# Altium schematic sheet FlyControl.SchDoc: FlyControl
size A4; Organization: Altium Limited; Address1: L3, 12a Rodborough Rd; Address2: Frenchs Forest; Address3: NSW; Address4: Australia 2086
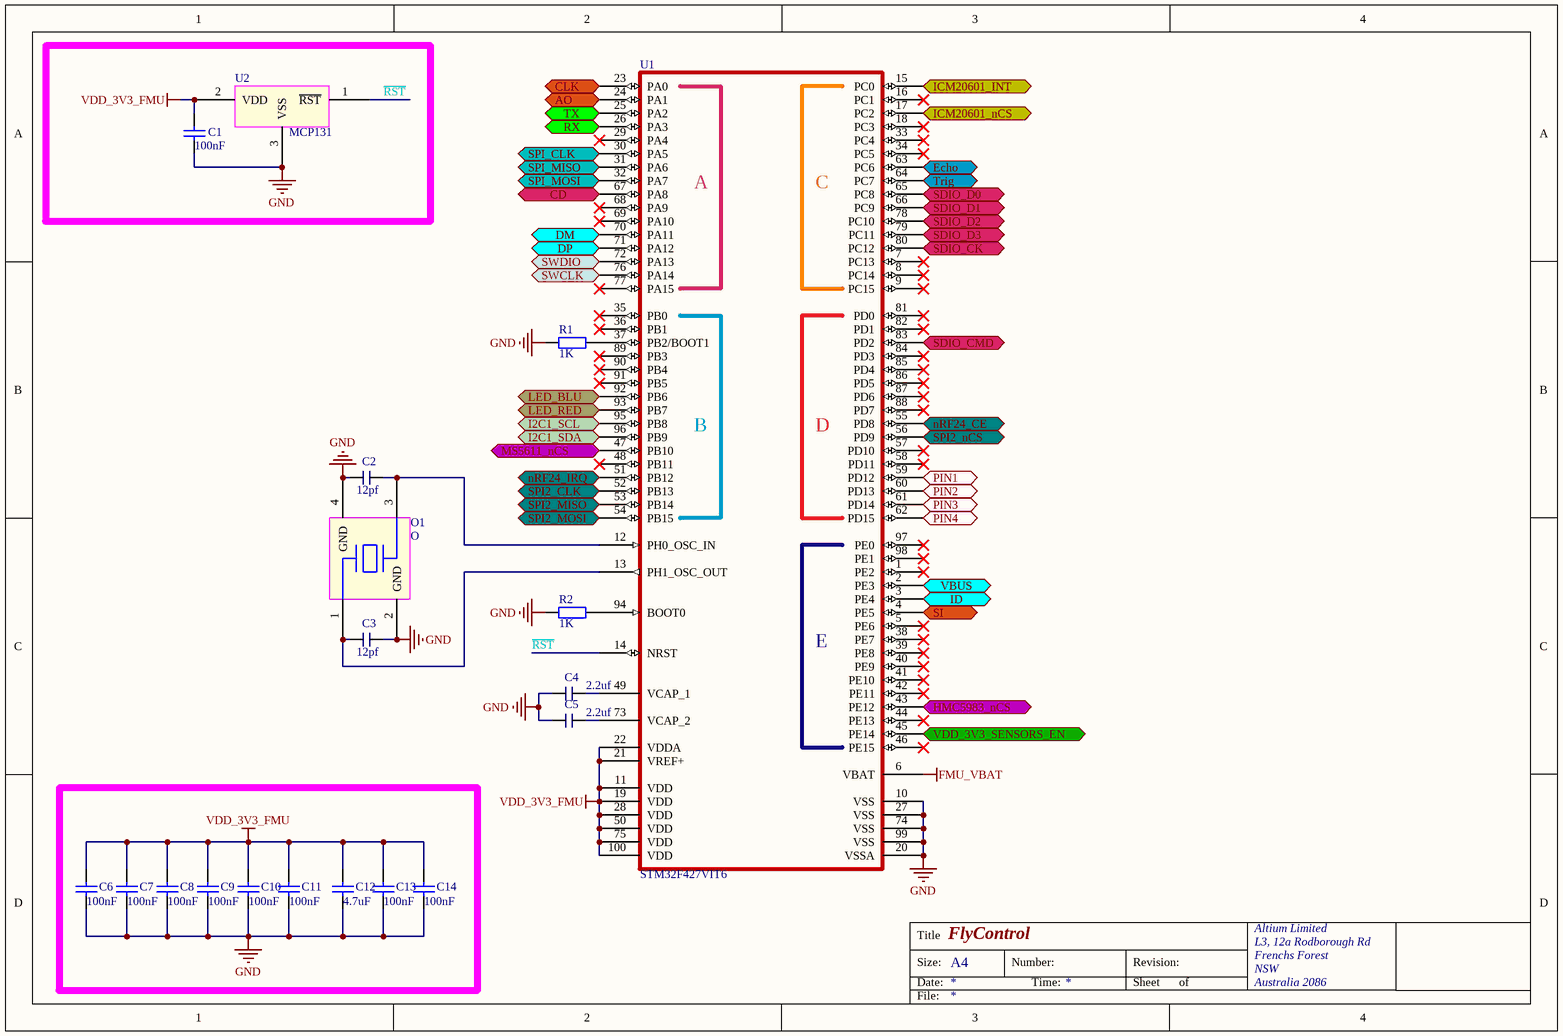
[diagram p0: FlyControl.SchDoc]

## Parts
C1  value 100nF  [0603AC]  (hidden comment: Cap1)
C2  value 12pf  [0603AC]  (hidden comment: Capacity)
C3  value 12pf  [0603AC]  (hidden comment: Capacity)
C4  value 2.2uf  [0603AC]  (hidden comment: Capacity)
C5  value 2.2uf  [0603AC]  (hidden comment: Capacity)
C6  value 100nF  [0603AC]  (hidden comment: Cap1)
C7  value 100nF  [0603AC]  (hidden comment: Cap1)
C8  value 100nF  [0603AC]  (hidden comment: Cap1)
C9  value 100nF  [0603AC]  (hidden comment: Cap1)
C10  value 100nF  [0603AC]  (hidden comment: Cap1)
C11  value 100nF  [0603AC]  (hidden comment: Cap1)
C12  value 4.7uF  [0603AC]  (hidden comment: Cap1)
C13  value 100nF  [0603AC]  (hidden comment: Cap1)
C14  value 100nF  [0603AC]  (hidden comment: Cap1)
O1  O  [SMD_3225]
R1  value 1K  [0603AR]  (hidden comment: Resist)
R2  value 1K  [0603AR]  (hidden comment: Resist)
U1  STM32F427VIT6  [LQFP50P1600X1600X160-100N]
U2  MCP131  [SOT23]

## Ports
AO, CD, CLK, DM, DP, Echo, HMC5983_nCS, I2C1_SCL, I2C1_SDA, ICM20601_INT, ICM20601_nCS, ID, LED_BLU, LED_RED, MS5611_nCS, nRF24_CE, nRF24_IRQ, PIN1, PIN2, PIN3, PIN4, RX, SDIO_CK, SDIO_CMD, SDIO_D0, SDIO_D1, SDIO_D2, SDIO_D3, SI, SPI2_CLK, SPI2_MISO, SPI2_MOSI, SPI2_nCS, SPI_CLK, SPI_MISO, SPI_MOSI, SWCLK, SWDIO, Trig, TX, VBUS, VDD_3V3_SENSORS_EN

## Nets
FMU_VBAT: U1.6(VBAT)
GND: C1.1 C2.1 C3.2 C4.1 C5.1 C6.1 C7.1 C8.1 C9.1 C10.1 C11.1 C12.1 C13.1 C14.1 O1.2(GND) O1.4(GND) R1.1 R2.1 U1.10(VSS) U1.20(VSSA) U1.27(VSS) U1.74(VSS) U1.99(VSS) U2.3(VSS)
VDD_3V3_FMU: C1.2 C6.2 C7.2 C8.2 C9.2 C10.2 C11.2 C12.2 C13.2 C14.2 U1.11(VDD) U1.19(VDD) U1.21(VREF+) U1.22(VDDA) U1.28(VDD) U1.50(VDD) U1.75(VDD) U1.100(VDD) U2.2(VDD)
AO: U1.24(PA1) ; port AO
CD: U1.67(PA8) ; port CD
CLK: U1.23(PA0) ; port CLK
DM: U1.70(PA11) ; port DM
DP: U1.71(PA12) ; port DP
Echo: U1.63(PC6) ; port Echo
HMC5983_nCS: U1.43(PE12) ; port HMC5983_nCS
I2C1_SCL: U1.95(PB8) ; port I2C1_SCL
I2C1_SDA: U1.96(PB9) ; port I2C1_SDA
ICM20601_INT: U1.15(PC0) ; port ICM20601_INT
ICM20601_nCS: U1.17(PC2) ; port ICM20601_nCS
ID: U1.3(PE4) ; port ID
LED_BLU: U1.92(PB6) ; port LED_BLU
LED_RED: U1.93(PB7) ; port LED_RED
MS5611_nCS: U1.47(PB10) ; port MS5611_nCS
nRF24_CE: U1.55(PD8) ; port nRF24_CE
nRF24_IRQ: U1.51(PB12) ; port nRF24_IRQ
PIN1: U1.59(PD12) ; port PIN1
PIN2: U1.60(PD13) ; port PIN2
PIN3: U1.61(PD14) ; port PIN3
PIN4: U1.62(PD15) ; port PIN4
~{RST}: U1.14(NRST) U2.1(~{RST})
RX: U1.26(PA3) ; port RX
SDIO_CK: U1.80(PC12) ; port SDIO_CK
SDIO_CMD: U1.83(PD2) ; port SDIO_CMD
SDIO_D0: U1.65(PC8) ; port SDIO_D0
SDIO_D1: U1.66(PC9) ; port SDIO_D1
SDIO_D2: U1.78(PC10) ; port SDIO_D2
SDIO_D3: U1.79(PC11) ; port SDIO_D3
SI: U1.4(PE5) ; port SI
SPI2_CLK: U1.52(PB13) ; port SPI2_CLK
SPI2_MISO: U1.53(PB14) ; port SPI2_MISO
SPI2_MOSI: U1.54(PB15) ; port SPI2_MOSI
SPI2_nCS: U1.56(PD9) ; port SPI2_nCS
SPI_CLK: U1.30(PA5) ; port SPI_CLK
SPI_MISO: U1.31(PA6) ; port SPI_MISO
SPI_MOSI: U1.32(PA7) ; port SPI_MOSI
SWCLK: U1.76(PA14) ; port SWCLK
SWDIO: U1.72(PA13) ; port SWDIO
Trig: U1.64(PC7) ; port Trig
TX: U1.25(PA2) ; port TX
VBUS: U1.2(PE3) ; port VBUS
VDD_3V3_SENSORS_EN: U1.45(PE14) ; port VDD_3V3_SENSORS_EN
NetC2_2: C2.2 O1.3(OSC) U1.12(PH0_OSC_IN)
NetC3_1: C3.1 O1.1(OSC) U1.13(PH1_OSC_OUT)
NetC4_2: C4.2 U1.49(VCAP_1)
NetC5_2: C5.2 U1.73(VCAP_2)
NetR1_2: R1.2 U1.37(PB2/BOOT1)
NetR2_2: R2.2 U1.94(BOOT0)

Not connected (* = marked no-connect by the designer): U1 1(PE2)* 5(PE6)* 7(PC13)* 8(PC14)* 9(PC15)* 16(PC1)* 18(PC3)* 29(PA4)* 33(PC4)* 34(PC5)* 35(PB0)* 36(PB1)* 38(PE7)* 39(PE8)* 40(PE9)* 41(PE10)* 42(PE11)* 44(PE13)* 46(PE15)* 48(PB11)* 57(PD10)* 58(PD11)* 68(PA9)* 69(PA10)* 77(PA15)* 81(PD0)* 82(PD1)* 84(PD3)* 85(PD4)* 86(PD5)* 87(PD6)* 88(PD7)* 89(PB3)* 90(PB4)* 91(PB5)* 97(PE0)* 98(PE1)*

## Notes on the sheet
- Title
- Size:
- Date:
- A4
- Number:
- Time:
- Revision:
- Sheet
- of
- File:
- (in symbol STM32F427VIT6) A; C; B; D; E

## Library data of the parts
C1 C6-C14 = Cap1: Capacitor; Published: 8-Jun-2000; LatestRevisionDate: 17-Jul-2002; LatestRevisionNote: Re-released for DXP Platform.; PackageReference: RAD-0.3; Publisher: Altium Limited; PackageDescription: Radial Cap, Thru-Hole; 2 Leads; 0.3 in Pin Spacing
C2-C5 = Cap
O1 = OSC
R1 R2 = Res